# Altium schematic sheet Ethernet.SchDoc: Evaluation Board 3.2
size A3; Organization: Toradex AG; Address1: Altsagenstrasse 5; Address2: Horw; Address3: 6048; Address4: Switzerland; DocumentNumber: 8; Revision: V3.2; SheetNumber: 8; SheetTotal: 23; PageSetup: Record=PageOptions|CenterHorizontal=True|CenterVertical=True|PrintScale=0.73|XCorrection=1.00|YCorrection=1.00|PrintKind=0|BorderSize=5000000|LeftOffset=0|BottomOffset=0|Orientation=2|PaperLength=1000|PaperWidth=1000|Scale=100|PaperSource=7|PrintQuality=-4|MediaType=1|DitherType=10|PaperKind=A4|PrintScaleMode=1
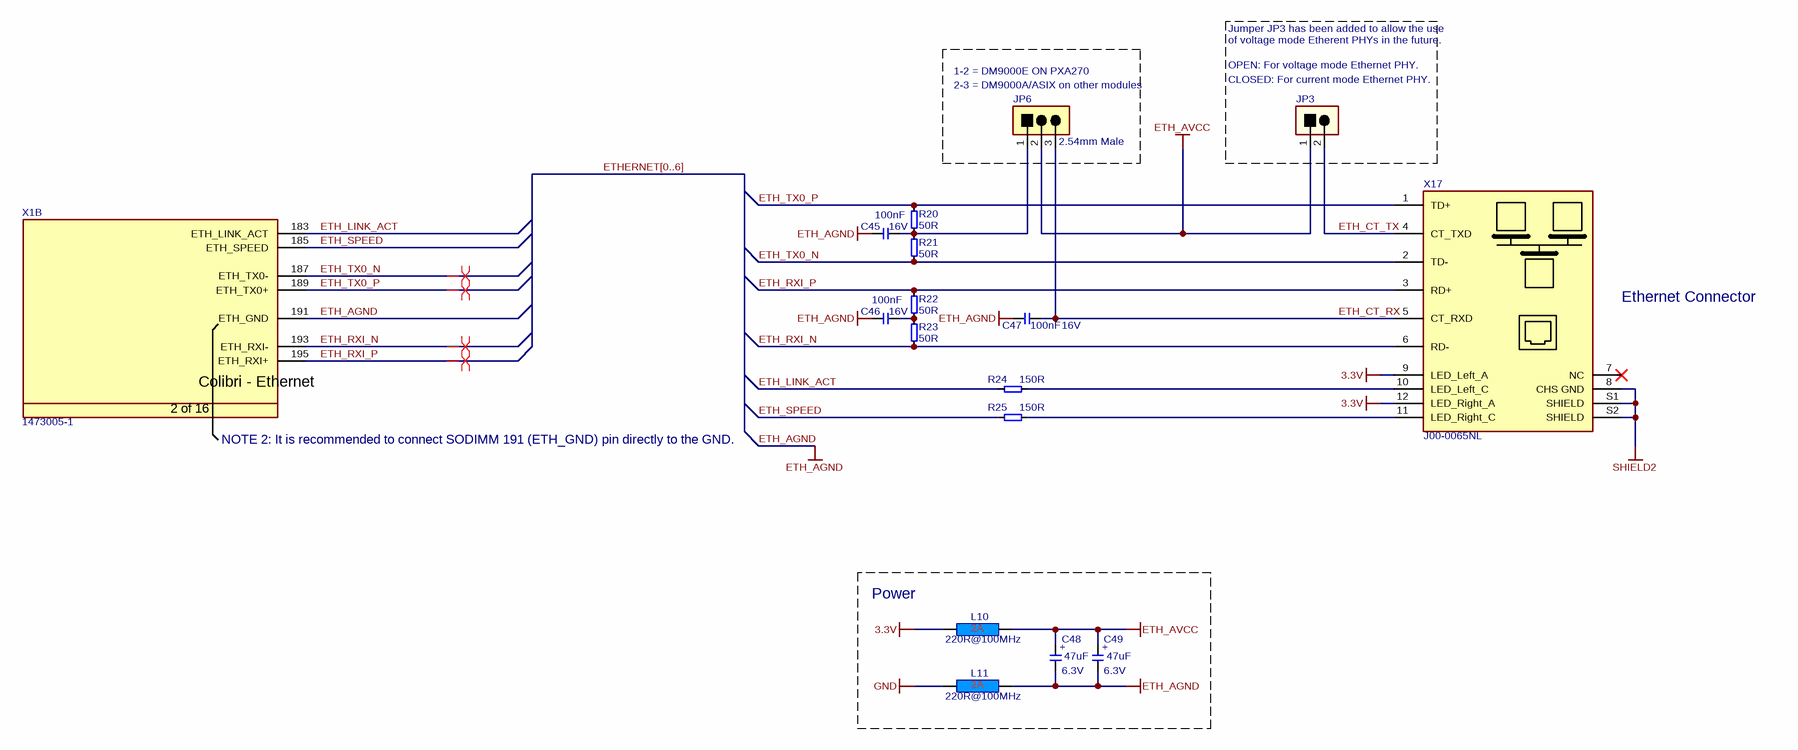
[diagram p0: Ethernet.SchDoc]

## Parts
C45  Rating: 16V  [T_CAPC0603X33N]  (hidden comment: 100nF)
C46  Rating: 16V  [T_CAPC0603X33N]  (hidden comment: 100nF)
C47  Rating: 16V  [T_CAPC0603X33N]  (hidden comment: 100nF)
C48  Rating: 6.3V  [CAPMP3528X210N]  (hidden comment: 47uF)
C49  Rating: 6.3V  [CAPMP3528X210N]  (hidden comment: 47uF)
JP3  TSW-101-07-G-D  [T_Samtec_TSW-101-07-G-D]  (value not drawn)
JP6  826936-3  [T_TYCO_826936-3]  (value not drawn)
L10  220R@100MHz  [INDC1608X95N]
L11  220R@100MHz  [INDC1608X95N]
R20  50R  [t_RESC0603X30N]
R21  50R  [t_RESC0603X30N]
R22  50R  [t_RESC0603X30N]
R23  50R  [t_RESC0603X30N]
R24  150R  [t_RESC0603X30N]
R25  150R  [t_RESC0603X30N]
X1  Manufacturer Part No.: 1473005-1  [T_Tyco_1473005-1]  (hidden comment: CON-Tyco-1473005-1-200-0.6mm)  (part B of 16)
X17  J00-0065NL  [T_Pulse_J00-0065NL]

## Blocks framed on the sheet
Power: C48 C49 L10 L11

## Nets
3.3V: L10.1 X17.9(LED_Left_A) X17.12(LED_Right_A)
ETH_AGND: C45.1 C46.1 C47.1 C48.2 C49.2 L11.2 X1.191(ETH_GND)
ETH_AVCC: C48.1 C49.1 JP3.1 JP6.2 L10.2
GND: L11.1
SHIELD2: X17.8(CHS_GND) X17.S1(SHIELD) X17.S2(SHIELD)
ETH_CT_RX: C47.2 JP6.3 X17.5(CT_RXD)
ETH_CT_TX: JP3.2 X17.4(CT_TXD)
ETH_LINK_ACT: R24.1 X1.183(ETH_LINK_ACT)
ETH_RXI_N: R23.1 X1.193(ETH_RXI-) X17.6(RD-)
ETH_RXI_P: R22.2 X1.195(ETH_RXI+) X17.3(RD+)
ETH_SPEED: R25.1 X1.185(ETH_SPEED)
ETH_TX0_N: R21.1 X1.187(ETH_TX0-) X17.2(TD-)
ETH_TX0_P: R20.2 X1.189(ETH_TX0+) X17.1(TD+)
NetC45_2: C45.2 JP6.1 R20.1 R21.2
NetC46_2: C46.2 R22.1 R23.2
NetR24_2: R24.2 X17.10(LED_Left_C)
NetR25_2: R25.2 X17.11(LED_Right_C)

Not connected (* = marked no-connect by the designer): X17 7(NC)*

## Buses and harness runs
bus ETHERNET[0..6]

## Layout directives
differential pair: ETH_RXI_N, ETH_RXI_P, ETH_TX0_N, ETH_TX0_P

## Notes on the sheet
- Jumper JP3 has been added to allow the use
- of voltage mode Etherent PHYs in the future.
- (near JP6) 1-2 = DM9000E ON PXA270
- (near JP6) 2-3 = DM9000A/ASIX on other modules
- (near JP3) CLOSED: For current mode Ethernet PHY.
- OPEN: For voltage mode Ethernet PHY.
- (near JP6) 2.54mm Male
- (near X17) Ethernet Connector
- NOTE 2: It is recommended to connect SODIMM 191 (ETH_GND) pin directly to the GND.
- Title
- Size:
- Date:
- A3
- Number:
- Time:
- Revision:
- Sheet
- of
- File:
- (in symbol C-TA-47uF-6.3V-20%-3216) +
- (in symbol CON-Tyco-1473005-1-200-0.6mm, part B) Colibri - Ethernet; 2 of 16

## Library data of the parts
C45-C47 = C-X7R-100nF-16V-10%-0603: Capacitor Ceramic X7R 100nF 16V 10% 0603; Tolerance: 10%; Type: X7R; Value: 100nF
C48 C49 = C-TA-47uF-6.3V-20%-3216: Capacitor TA 47uF 6.3V 20% 3216; Tolerance: 20%; Type: TA; Value: 47uF
JP3 = CON-Samtec-TSW-101-07-G-D: Header male, 1x2 Pins, 2.54 mm pitch; Manufacturer Name: Samtec; Pitch: 2.54 mm; No. of ways: 1x2; Manufacturer Part no.: TSW-101-07-G-D
JP6 = CON-Tyco-826936-3-1X3-2.54mm-JP: Jumper, 3-Pin; Manufacturer Name: Tyco; No. of ways: 1X3; Pitch: 2.54mm; Manufacturer Part No.: 826936-3
L10 L11 = L-220R@100MHz-2A-25%-0603: 220R@100MHz 2A EMI FILTER; Tolerance: 25%; Rating: 2A; Value: 220R@100MHz
R20-R23 = R-50R-63mW-1%-0603: Resistor 50 ohm 63mW 1% 0603; Rating: 63mW; Tolerance: 1%; Value: 50R
R24 R25 = R-150R-63mW-1%-0603: Resistor 150 ohm 63mW 1% 0603; Tolerance: 1%; Value: 150R; Rating: 63mW
X1 = CON-Tyco-1473005-1-200-0.6mm: SODIMM Connector; Manufacturer Name: Tyco; No. of ways: 200
X17 = CON-Pulse-J00-0065NL: RJ45 Connector; Manufacturer Name: Pulse; No. of ways: 12; Manufacturer Part No.: J00-0065NL